# Altium schematic sheet Power.SchDoc
size A
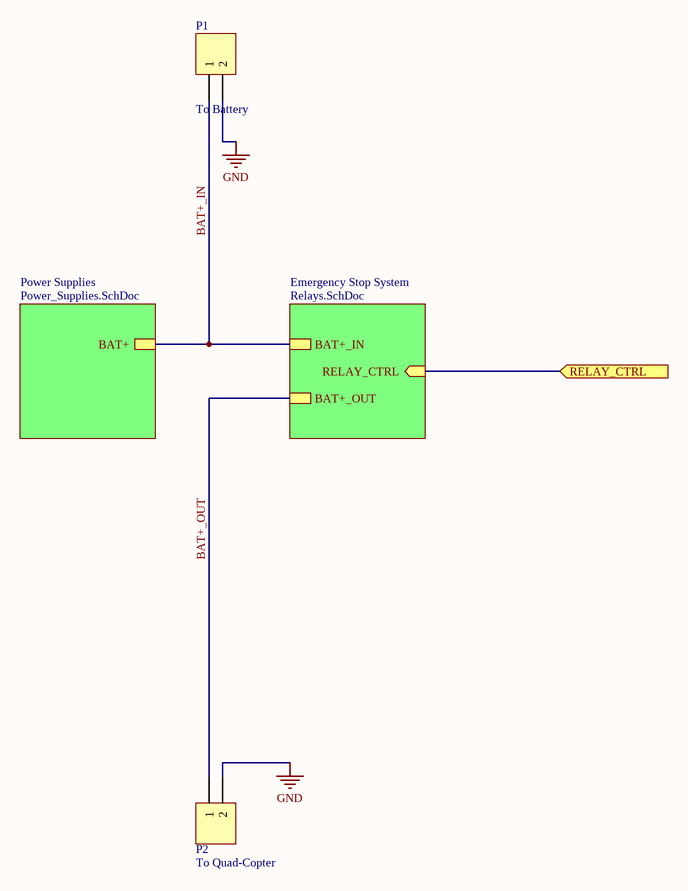
[diagram p0: Power.SchDoc]

## Parts
P1  To Battery  [XT60]
P2  To Quad-Copter  [XT60]

## Sub-sheets
Emergency Stop System = Relays.SchDoc: BAT+_IN, BAT+_OUT, RELAY_CTRL (in)
Power Supplies = Power_Supplies.SchDoc: BAT+

## Ports
RELAY_CTRL (in)

## Nets
GND: P1.2 P2.2
BAT+_IN: P1.1 ; sheet Power Supplies/BAT+, sheet Emergency Stop System/BAT+_IN
BAT+_OUT: P2.1 ; sheet Emergency Stop System/BAT+_OUT
RELAY_CTRL: port RELAY_CTRL, sheet Emergency Stop System/RELAY_CTRL

## Library data of the parts
P1 P2 = Header 2: XT60; Manufacturer Part Number: PRT-10474; Manufacturer: SparkFun; Supplier 1: Mouser; Supplier Part Number 1: 474-PRT-10474